# EAGLE design Carte_Fischertechnik_V3 (EAGLE 9.0.1)
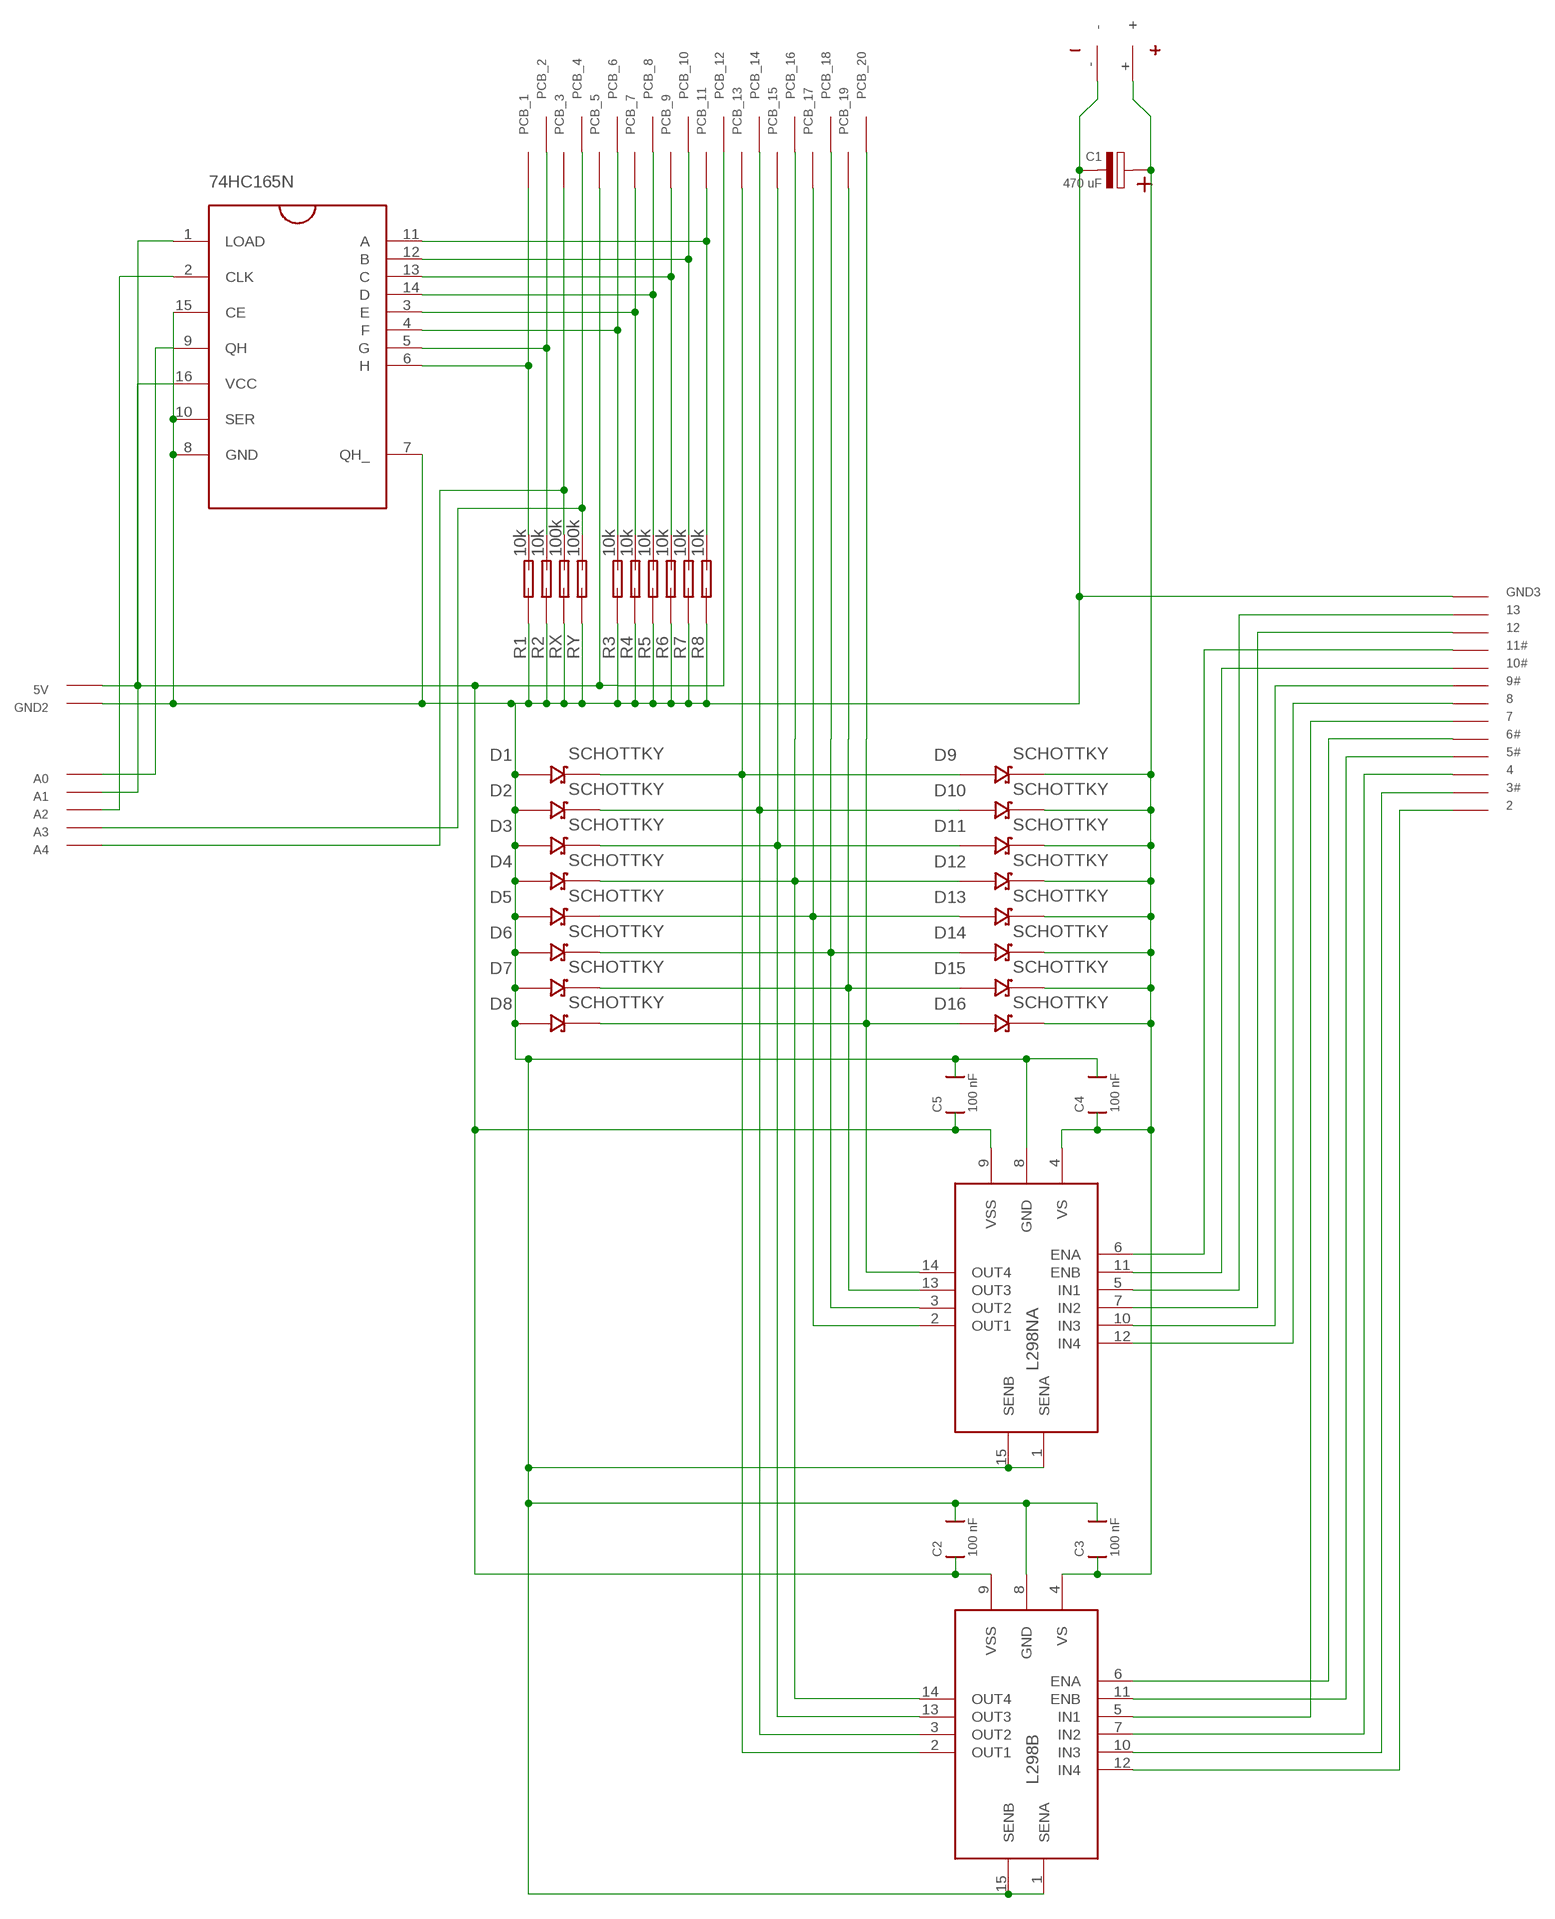
[diagram p0: schematic, sheet 1]

## Parts
2  PAD_O  [PAD_O]
3#  PAD_O  [PAD_O]
4  PAD_O  [PAD_O]
5#  PAD_O  [PAD_O]
5V  5V  PAD_O  [PAD_O]
6#  PAD_O  [PAD_O]
7  PAD_O  [PAD_O]
8  PAD_O  [PAD_O]
9#  PAD_O  [PAD_O]
10#  PAD_O  [PAD_O]
11#  PAD_O  [PAD_O]
12  PAD_O  [PAD_O]
13  PAD_O  [PAD_O]
74HC165N  74HC165N  [74HC165N]
A0  PAD_O  [PAD_O]
A1  PAD_O  [PAD_O]
A2  PAD_O  [PAD_O]
A3  PAD_O  [PAD_O]
A4  PAD_O  [PAD_O]
C1  470 uF  POLARIZED_CAPACITOR  [POLARIZED_CAPACITOR]
C2  100 nF  CAPACITOR  [CAPACITOR]
C3  100 nF  CAPACITOR  [CAPACITOR]
C4  100 nF  CAPACITOR  [CAPACITOR]
C5  100 nF  CAPACITOR  [CAPACITOR]
D1  SCHOTTKY  [SCHOTTKY]
D2  SCHOTTKY  [SCHOTTKY]
D3  SCHOTTKY  [SCHOTTKY]
D4  SCHOTTKY  [SCHOTTKY]
D5  SCHOTTKY  [SCHOTTKY]
D6  SCHOTTKY  [SCHOTTKY]
D7  SCHOTTKY  [SCHOTTKY]
D8  SCHOTTKY  [SCHOTTKY]
D9  SCHOTTKY  [SCHOTTKY]
D10  SCHOTTKY  [SCHOTTKY]
D11  SCHOTTKY  [SCHOTTKY]
D12  SCHOTTKY  [SCHOTTKY]
D13  SCHOTTKY  [SCHOTTKY]
D14  SCHOTTKY  [SCHOTTKY]
D15  SCHOTTKY  [SCHOTTKY]
D16  SCHOTTKY  [SCHOTTKY]
GND2  GND  PAD_O  [PAD_O]
GND3  PAD_O  [PAD_O]
L298B  L298N  [L298N]
L298NA  L298N  [L298N]
PCB_1  PAD_C  [PAD_C]
PCB_2  PAD_C  [PAD_C]
PCB_3  PAD_C  [PAD_C]
PCB_4  PAD_C  [PAD_C]
PCB_5  PAD_C  [PAD_C]
PCB_6  PAD_C  [PAD_C]
PCB_7  PAD_C  [PAD_C]
PCB_8  PAD_C  [PAD_C]
PCB_9  PAD_C  [PAD_C]
PCB_10  PAD_C  [PAD_C]
PCB_11  PAD_C  [PAD_C]
PCB_12  PAD_C  [PAD_C]
PCB_13  PAD_C  [PAD_C]
PCB_14  PAD_C  [PAD_C]
PCB_15  PAD_C  [PAD_C]
PCB_16  PAD_C  [PAD_C]
PCB_17  PAD_C  [PAD_C]
PCB_18  PAD_C  [PAD_C]
PCB_19  PAD_C  [PAD_C]
PCB_20  PAD_C  [PAD_C]
R1  10k  RESISTANCE  [RESISTANCE]
R2  10k  RESISTANCE  [RESISTANCE]
R3  10k  RESISTANCE  [RESISTANCE]
R4  10k  RESISTANCE  [RESISTANCE]
R5  10k  RESISTANCE  [RESISTANCE]
R6  10k  RESISTANCE  [RESISTANCE]
R7  10k  RESISTANCE  [RESISTANCE]
R8  10k  RESISTANCE  [RESISTANCE]
RX  100k  RESISTANCE  [RESISTANCE]
RY  100k  RESISTANCE  [RESISTANCE]
U$1  ADAPTATEUR_FTK  [ADAPTATEUR_FTK]

## Nets
N$1: D1.+ D9.- L298B.2(OUT1) PCB_13.$1
N$2: 5V.P$1 74HC165N.16(VCC) C2.P$1 C5.P$1 L298B.9(VSS) L298NA.9(VSS) PCB_5.$1 PCB_12.$1
N$3: 74HC165N.5(G) PCB_2.$1 R2.P$2(B)
N$4: D2.+ D10.- L298B.3(OUT2) PCB_14.$1
N$5: D3.+ D11.- L298B.13(OUT3) PCB_15.$1
N$6: 74HC165N.7(QH_) 74HC165N.8(GND) 74HC165N.10(SER) 74HC165N.15(CE) C1.P$2(-) C2.P$2 C3.P$2 C4.P$2 C5.P$2 D1.- D2.- D3.- D4.- D5.- D6.- D7.- D8.- GND2.P$1 GND3.P$1 L298B.1(SENA) L298B.8(GND) L298B.15(SENB) L298NA.1(SENA) L298NA.8(GND) L298NA.15(SENB) R1.P$1(A) R2.P$1(A) R3.P$1(A) R4.P$1(A) R5.P$1(A) R6.P$1(A) R7.P$1(A) R8.P$1(A) RX.P$1(A) RY.P$1(A) U$1.-
N$8: D5.+ D13.- L298NA.2(OUT1) PCB_17.$1
N$9: C1.P$1(+) C3.P$1 C4.P$1 D9.+ D10.+ D11.+ D12.+ D13.+ D14.+ D15.+ D16.+ L298B.4(VS) L298NA.4(VS) U$1.+
N$11: D4.+ D12.- L298B.14(OUT4) PCB_16.$1
N$12: 74HC165N.9(QH) A0.P$1
N$13: 74HC165N.2(CLK) A2.P$1
N$14: 74HC165N.1(LOAD) A1.P$1
N$15: 74HC165N.6(H) PCB_1.$1 R1.P$2(B)
N$16: A4.P$1 PCB_3.$1 RX.P$2(B)
N$17: A3.P$1 PCB_4.$1 RY.P$2(B)
N$19: 74HC165N.4(F) PCB_6.$1 R3.P$2(B)
N$20: 74HC165N.3(E) PCB_7.$1 R4.P$2(B)
N$21: 74HC165N.14(D) PCB_8.$1 R5.P$2(B)
N$22: 74HC165N.13(C) PCB_9.$1 R6.P$2(B)
N$23: 74HC165N.12(B) PCB_10.$1 R7.P$2(B)
N$24: 74HC165N.11(A) PCB_11.$1 R8.P$2(B)
N$27: 11#.P$1 L298NA.6(ENA)
N$28: 10#.P$1 L298NA.11(ENB)
N$29: 13.P$1 L298NA.5(IN1)
N$30: 12.P$1 L298NA.7(IN2)
N$31: D6.+ D14.- L298NA.3(OUT2) PCB_18.$1
N$32: D7.+ D15.- L298NA.13(OUT3) PCB_19.$1
N$33: D8.+ D16.- L298NA.14(OUT4) PCB_20.$1
N$34: 9#.P$1 L298NA.10(IN3)
N$35: 8.P$1 L298NA.12(IN4)
N$38: 7.P$1 L298B.5(IN1)
N$39: 6#.P$1 L298B.6(ENA)
N$40: 5#.P$1 L298B.11(ENB)
N$41: 4.P$1 L298B.7(IN2)
N$42: 3#.P$1 L298B.10(IN3)
N$43: 2.P$1 L298B.12(IN4)

## Library data of the parts
2 3# 4 5# 5V 6# 7 8 9# 10# 11# 12 13 A0 A1-A4 GND2 GND3 = Fischertechnik:PAD_O
74HC165N = Fischertechnik:74HC165N
C1 = Fischertechnik:POLARIZED_CAPACITOR
C2-C5 = Fischertechnik:CAPACITOR
D1-D16 = Fischertechnik:SCHOTTKY
L298B L298NA = Fischertechnik:L298N
PCB_1-PCB_20 = Fischertechnik:PAD_C
R1-R8 RX RY = Fischertechnik:RESISTANCE
U$1 = Ftk:ADAPTATEUR_FTK

## Net classes
0 default: width 0.5 mm, drill 0.3 mm, clearance 0.5 mm

## Board
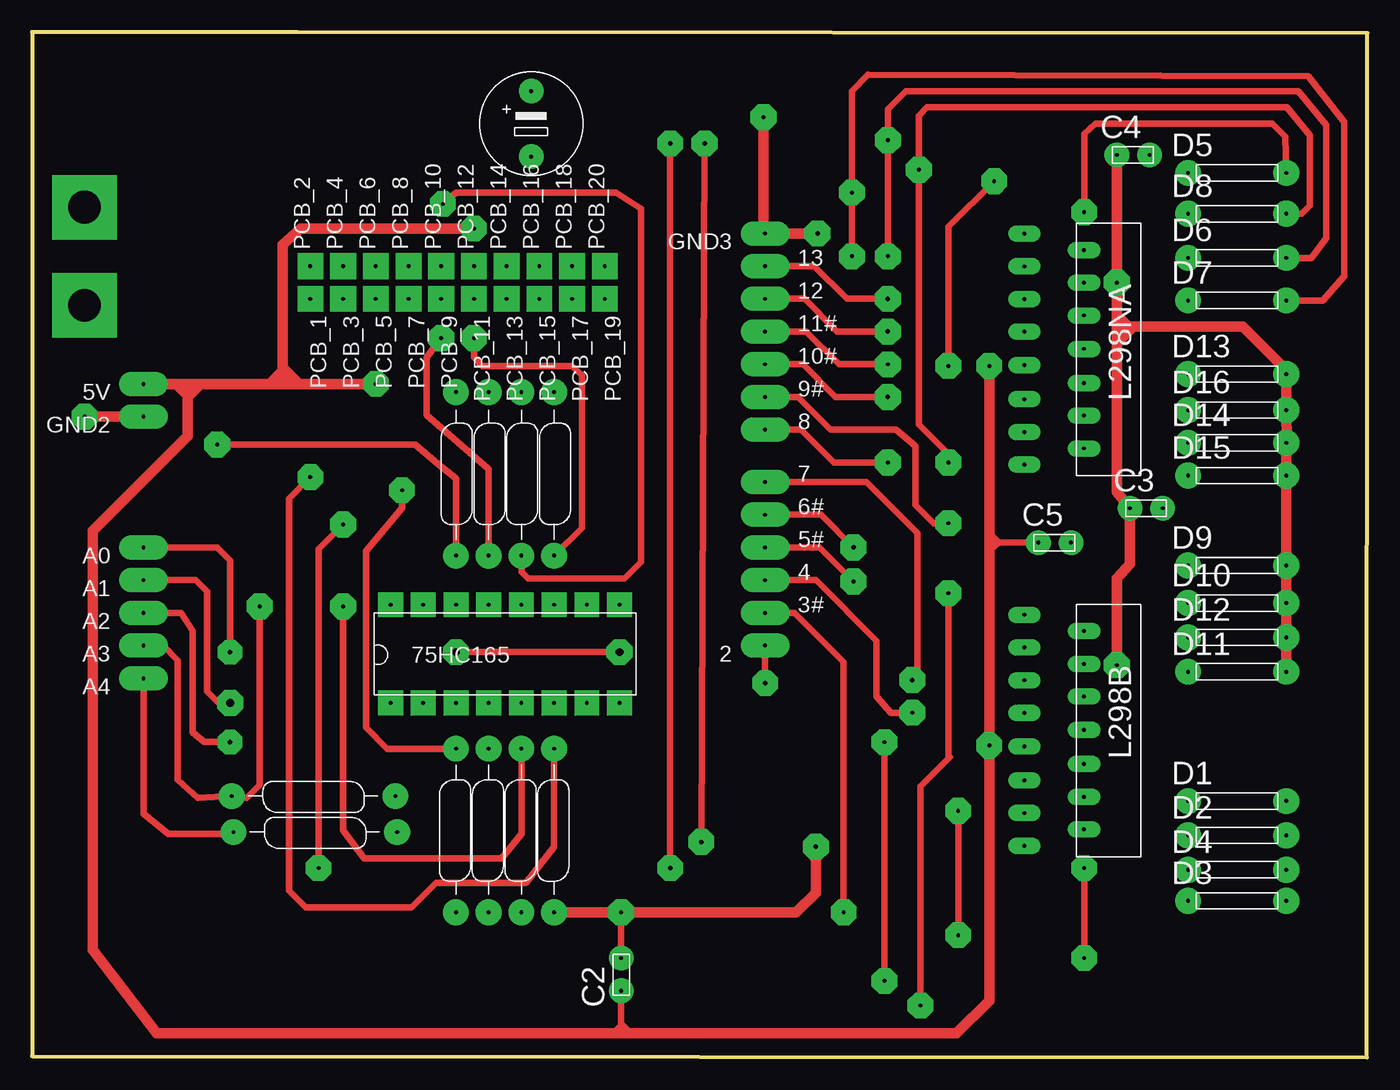
[diagram p1: board, top side]
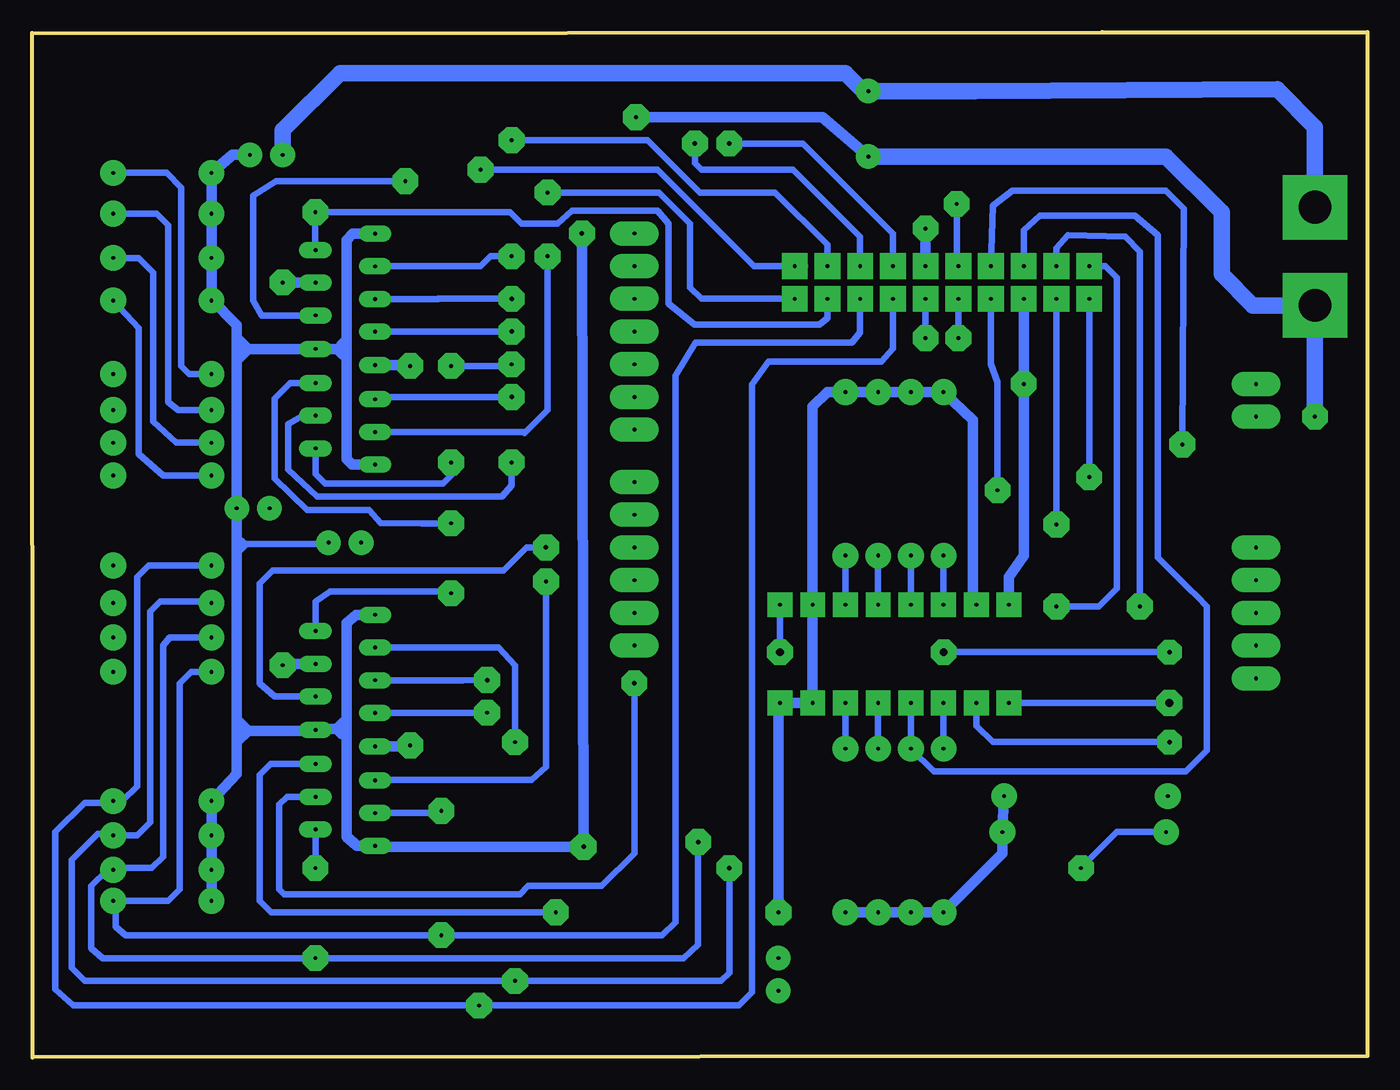
[diagram p2: board, bottom side, seen from below]

Size 103.64 x 79.6 mm. Coordinates in mm from the lower left corner, seen from the top.
Outline: 0,0.1 103.62,0 103.64,79.53 20.57,79.6 0,79.6 0,0.1
Copper layers (1*16): Top 0.035mm / dielectric 1.5mm / Bottom 0.035mm
Design rules "default *": minimum track width 6mil, minimum drill 0.35mm, track to track 2mil, track to pad 2mil, pad to pad 6mil, via to via 6mil, smd to smd 6mil, copper to edge 40mil, drill to drill 6mil, minimum pad ring 10mil, minimum via ring 8mil, stop-mask expansion 4mil, vias tented up to drill 0mil, thermal gap 10mil

### Footprints (pad centres in the part's own frame; a part is rotated, then mirrored left to right if it is on the bottom)
PAD_O = drill 0.3 pad 1.905 long: P$1 0,0
74HC165N = drill 0.3 pad 1.93 square: 1 -3.175,7.62; 2 -3.175,5.08; 3 -3.175,2.54; 4 -3.175,0; 5 -3.175,-2.54; 6 -3.175,-5.08; 7 -3.175,-7.62; 8 -3.175,-10.16; 9 4.445,-10.16; 10 4.445,-7.62; 11 4.445,-5.08; 12 4.445,-2.54; 13 4.445,0; 14 4.445,2.54; 15 4.445,5.08; 16 4.445,7.62
POLARIZED_CAPACITOR = drill 0.3 pad 1.91: P$1 -2.54,0; P$2 2.54,0
CAPACITOR = drill 0.3 pad 1.91: P$1 -1.27,0; P$2 1.27,0
SCHOTTKY = drill 0.3 pad 2: + 3.81,0; - -3.81,0
L298N = drill 0.3 pad 1.27 long: 1 -6.547,9; 2 -1.917,7.73; 3 -6.547,6.46; 4 -1.917,5.19; 5 -6.547,3.92; 6 -1.917,2.65; 7 -6.547,1.38; 8 -1.917,0.05; 9 -6.547,-1.22; 10 -1.917,-2.59; 11 -6.547,-3.86; 12 -1.917,-5.13; 13 -6.547,-6.4; 14 -1.917,-7.67; 15 -6.547,-8.94
PAD_C = drill 0.3 pad 2 square: $1 0,0
RESISTANCE = drill 0.3 pad 2: P$1 0,6.35; P$2 0,-6.35
ADAPTATEUR_FTK = drill 2.54 pad 5 square: + 3.81,0; - -3.81,0

### Placement (x,y rotation side)
2  56.9,31.98 90 top
3#  56.9,34.52 270 top
4  56.9,37.06 270 top
5#  56.9,39.6 270 top
5V  8.64,52.3 90 top
6#  56.9,42.14 270 top
7  56.9,44.68 270 top
8  56.9,48.74 270 top
9#  56.9,51.28 270 top
10#  56.9,53.82 270 top
11#  56.9,56.36 270 top
12  56.9,58.9 270 top
13  56.9,61.44 270 top
74HC165N  35.43,30.71 90 top
A0  8.64,39.6 90 top
A1  8.64,37.06 90 top
A2  8.64,34.52 90 top
A3  8.64,31.98 90 top
A4  8.64,29.44 90 top
C1  38.73,72.49 270 top
C2  45.72,6.45 90 top
C3  86.49,42.64 0 top
C4  85.47,70.08 0 top
C5  79.38,39.98 0 top
D1  93.54,19.91 0 top
D2  93.54,17.24 0 top
D3  93.54,12.16 0 top
D4  93.54,14.58 0 top
D5  93.54,68.68 0 top
D6  93.54,62.08 0 top
D7  93.54,58.77 0 top
D8  93.54,65.5 0 top
D9  93.54,38.2 0 top
D10  93.54,35.28 0 top
D11  93.54,29.95 0 top
D12  93.54,32.61 0 top
D13  93.54,53.06 0 top
D14  93.54,47.72 0 top
D15  93.54,45.19 0 top
D16  93.54,50.27 0 top
GND2  8.64,49.76 90 top
GND3  56.9,63.98 90 top
L298B  83.57,25.37 0 top
L298NA  83.57,54.96 0 top
PCB_1  21.59,58.9 180 top
PCB_2  21.59,61.44 0 top
PCB_3  24.13,58.9 180 top
PCB_4  24.13,61.44 0 top
PCB_5  26.67,58.9 180 top
PCB_6  26.67,61.44 0 top
PCB_7  29.21,58.9 180 top
PCB_8  29.21,61.44 0 top
PCB_9  31.75,58.9 180 top
PCB_10  31.75,61.44 0 top
PCB_11  34.29,58.9 180 top
PCB_12  34.29,61.44 0 top
PCB_13  36.83,58.9 180 top
PCB_14  36.83,61.44 0 top
PCB_15  39.37,58.9 180 top
PCB_16  39.37,61.44 0 top
PCB_17  41.91,58.9 180 top
PCB_18  41.91,61.44 0 top
PCB_19  44.45,58.9 180 top
PCB_20  44.45,61.44 0 top
R1  40.51,17.63 180 top
R2  37.97,17.63 180 top
R3  35.43,17.63 180 top
R4  32.89,17.63 180 top
R5  32.89,45.31 0 top
R6  35.43,45.31 0 top
R7  37.97,45.31 0 top
R8  40.51,45.31 0 top
RX  21.97,17.5 270 top
RY  21.84,20.29 270 top
U$1  4.06,62.2 90 top

### Tracks (layer width: path | path; a pad name or v marks a point on that pad's centre or on a via)
N$1  (via drill 0.3 pad 2)
  Top 0.5: v71.12,36.04 71.12,23.47 71.25,23.34 68.96,21.05 v68.96,4.04
  Bottom 0.5: PCB_13.$1 36.83,57.63 | 36.83,57.63 36.83,56.36 | L298B.2 81.65,35.42 80.52,36.17 73.53,36.17 | 73.53,36.17 73.28,36.17 | 36.83,57.63 36.83,55.03 37.72,54.01 46.48,54.01 47.75,52.23 47.75,5.05 48.77,4.04 v68.96,4.04 100.46,4.04 101.85,5.31 101.85,17.5 99.57,19.79 97.15,19.79 D1.+ 96.65,19.91 95.5,21.05 95.5,37.31 94.61,38.2 D9.- | 73.53,36.17 71.25,36.17 v71.12,36.04
N$2  (via drill 0.3 pad 2)
  Top 0.5: C2.P$1 45.72,2.64 | 45.72,2.64 45.72,2.39 | 45.72,2.39 45.72,1.88 | 43.81,2 43.81,1.88 | 45.72,2.64 45.72,2.51 45.09,1.88 | 45.72,2.39 46.23,1.88 46.74,1.88 46.48,1.88 45.72,2.64 | C5.P$1 75.56,39.98 | 75.56,39.98 74.42,39.98 74.29,39.85 | 74.29,40.74 75.06,39.98 | 75.06,39.98 75.56,39.98 | 75.56,39.98 74.93,39.98 74.29,39.34 75.06,39.98
  Top 0.8: v34.29,64.36 20.83,64.36 19.43,63.09 19.43,53.57 | 16.51,52.3 13.34,52.3 | 13.34,52.3 12.06,52.3 | 12.06,52.3 11.18,52.3 | 11.18,52.3 5V.P$1 | 16.76,52.3 16.51,52.3 | 16.51,52.3 18.41,52.3 | 18.41,52.3 19.43,52.3 | 19.43,52.3 20.57,52.3 | 20.57,52.3 v26.67,52.3 | 19.43,53.57 19.43,52.3 | 18.41,52.3 19.43,53.31 19.43,53.57 | 19.43,53.57 20.57,52.42 20.57,52.3 | v74.29,53.69 74.29,40.74 74.29,39.85 74.29,39.34 74.29,26.26 v74.29,24.23 74.29,4.42 71.75,1.88 46.74,1.88 45.72,1.88 45.09,1.88 43.81,1.88 43.18,1.88 42.42,1.88 9.65,1.88 4.7,8.35 4.7,40.87 12.06,48.23 12.06,51.28 | 12.06,51.28 12.06,52.3 | 11.18,52.3 12.06,51.41 12.06,51.28 | 12.06,51.28 13.08,52.3 13.34,52.3
  Bottom 0.8: v34.29,64.36 PCB_12.$1 | L298NA.9 74.34,53.74 v74.29,53.69 | L298B.9 74.37,24.15 v74.29,24.23 | PCB_5.$1 v26.67,52.3 26.67,38.96 27.81,37.31 74HC165N.16
N$3  (via drill 0.3 pad 2)
  Top 0.5: v24.13,35.02 24.13,17.63 25.78,15.47 36.45,15.47 37.97,17.37 R2.P$2
  Bottom 0.5: 74HC165N.5 R2.P$2 | PCB_2.$1 20.32,61.44 19.43,60.55 19.43,36.42 20.83,35.02 v24.13,35.02
N$4  (via drill 0.3 pad 2, 0.35 pad 2)
  Top 0.5: v49.53,70.97 v49.53,14.7 | v66.17,24.48 v66.17,5.94
  Bottom 0.5: v49.53,14.7 49.53,6.58 50.16,5.94 v66.17,5.94 99.57,5.94 100.58,6.96 100.58,15.34 98.55,17.37 97.15,17.37 | 97.15,17.37 D2.+ | L298B.3 67.42,31.83 66.17,30.45 v66.17,24.48 | D10.- 89.85,35.41 93.73,35.41 94.49,34.64 94.49,18.26 95.5,17.24 97.03,17.24 97.15,17.37 | v49.53,70.97 43.81,70.97 36.83,63.98 PCB_14.$1
N$5  (via drill 0.3 pad 2)
  Top 0.5: v71.88,19.15 v71.88,9.5
  Bottom 0.5: PCB_15.$1 39.37,56.28 40.01,55.52 52.15,55.52 53.72,52.93 53.72,10.51 54.74,9.5 v71.88,9.5 96.39,9.5 97.15,10.13 97.15,12.04 D3.+ 93.09,12.16 92.2,13.05 92.2,29.06 91.31,29.95 D11.- | L298B.13 72.06,18.97 v71.88,19.15
N$6  (via drill 0.3 pad 2, 0.35 pad 2)
  Top 0.5: C2.P$2 v45.72,11.28
  Top 0.8: v4.06,49.76 GND2.P$1 | v60.96,63.98 GND3.P$1 56.77,64.11 v56.77,73 | R1.P$1 v45.72,11.28 59.31,11.28 60.83,12.8 v60.83,16.36
  Bottom 0.5: 79.96,55.01 79.63,55.34 79.63,54.71 79.64,54.7 | 79.25,26.39 79.5,26.01 | 81.57,25.5 L298B.8 | 79.25,24.61 79.63,25.12 79.5,25.25 | 79.25,54.3 79.25,53.82 | 87.76,39.85 87.12,39.85 | 86.99,39.85 80.77,39.85 C5.P$2 | 87.76,40.49 87.12,39.85 | 87.12,39.85 86.99,39.85 | 87.76,38.71 87.76,39.09 86.99,39.85
  Bottom 0.8: R1.P$1 R2.P$1 R3.P$1 R4.P$1 28.32,15.85 RX.P$1 RY.P$1 | 74HC165N.15 30.61,35.15 30.61,49.5 R5.P$1 R6.P$1 R7.P$1 R8.P$1 41.91,51.66 43.05,50.52 74HC165N.10 74HC165N.7 74HC165N.8 45.72,27.4 v45.72,11.28 45.59,11.4 | L298NA.1 78.76,63.96 79.25,63.47 79.25,55.73 | 79.25,55.73 79.63,55.34 | L298NA.15 78.82,46.02 79.25,46.45 79.25,53.82 79.25,55.73 | L298B.1 78.5,34.37 79.25,33.75 79.25,26.39 79.25,24.61 79.25,17.12 78.44,16.43 L298B.15 76.84,16.36 v60.83,16.36 v60.96,63.98 | 80.01,25.5 79.5,26.01 79.5,25.25 | 80.01,25.5 81.57,25.5 81.7,25.37 86.87,25.37 | 79.63,25.12 80.01,25.5 | 79.25,54.3 79.64,54.7 79.96,55.01 L298NA.8 86.87,55.01 | C1.P$2 42.29,73 v56.77,73 | 89.79,58.9 D7.- | 87.76,25.37 86.87,25.37 | D3.- D4.- D2.- D1.- 87.76,22.01 87.76,24.48 | 87.76,24.48 87.76,25.37 | 87.76,25.37 87.76,26.26 | 86.87,25.37 87.76,26.26 | 86.87,25.37 87.76,24.48 | C4.P$2 88.07,70.08 D5.- D8.- D6.- 89.73,58.96 89.79,58.9 | 87.76,54.12 87.76,54.96 | 87.76,54.96 87.76,55.9 | 87.76,55.9 87.76,56.87 89.79,58.9 | 87.76,54.96 87.71,55.01 86.87,55.01 | 86.87,55.01 87.76,55.9 | 86.87,55.01 87.76,54.12 | 87.76,54.12 C3.P$2 87.76,40.49 87.76,39.85 87.76,38.71 87.76,26.26
  Bottom 1.27: C1.P$2 15.62,69.95 11.3,65.63 11.3,60.81 8.89,58.39 U$1.- v4.06,49.76
N$8  (via drill 0.3 pad 2)
  Top 0.5: v81.66,65.63 81.66,71.73 82.55,72.49 96.27,72.49 97.28,71.47 D5.+
  Bottom 0.5: L298NA.2 81.66,62.83 81.66,64.74 | 81.66,64.74 v81.66,65.63 | PCB_17.$1 41.91,57.41 42.55,56.9 52.23,56.9 54.23,58.52 54.23,64.74 55.12,65.76 61.72,65.76 62.87,64.74 65.66,64.74 66.55,65.63 v81.66,65.63 | 81.66,64.74 v81.66,65.63 | D5.+ 93.22,68.68 92.07,67.54 92.07,53.69 91.44,53.06 D13.-
N$9  (via drill 0.3 pad 2)
  Top 0.8: 84.2,57.63 v84.2,60.17 84.2,66.12 84.21,67.13 84.21,70.45 C4.P$1 | 84.2,57.63 84.2,56.74 | 84.2,56.74 85.09,56.74 | 85.47,56.74 93.98,56.74 97.41,53.31 D13.+ D16.+ 97.41,47.72 D14.+ D15.+ D9.+ D10.+ D12.+ D11.+ | 84.2,56.74 84.2,55.47 | 84.2,57.63 85.09,56.74 | 85.09,56.74 85.47,56.74 | 84.2,55.47 85.47,56.74 | 84.2,55.47 84.2,43.91 C3.P$1 85.22,38.33 84.2,37.18 v84.2,30.45
  Bottom 0.8: L298NA.4 83.29,60.15 v84.2,60.17 | v84.2,30.45 84.09,30.56 L298B.4 | 30.48,75.03 30.54,74.97
  Bottom 1.27: U$1.+ 4.06,72.24 6.98,75.16 30.48,75.03 C1.P$1 39.12,75.03 40.51,76.43 79.76,76.43 84.2,71.98 C4.P$1
N$11  (via drill 0.3 pad 2, 0.35 pad 2)
  Top 0.5: v52.2,70.97 v51.94,16.74 | v81.66,14.7 v81.66,7.72
  Bottom 0.5: v51.94,16.74 51.94,8.74 53.09,7.72 v81.66,7.72 98.17,7.72 99.06,8.48 99.06,13.31 97.79,14.58 D4.+ 97.22,14.7 94.36,14.7 93.47,15.59 93.47,31.98 92.96,32.61 D12.- | v81.66,14.7 81.65,14.72 L298B.14 | v52.2,70.97 52.2,69.44 51.69,68.93 44.58,68.93 39.37,63.73 PCB_16.$1
N$12  (via drill 0.35 pad 1.9, 0.6 pad 2)
  Top 0.5: v15.37,31.47 15.37,38.58 14.35,39.6 A0.P$1 | v32.89,31.47 v45.59,31.47
  Bottom 0.5: v15.37,31.47 v32.89,31.47 | v45.59,31.47 74HC165N.9
N$13  (via drill 0.35 pad 1.9)
  Top 0.5: 15.24,24.36 v15.37,24.48 13.34,24.48 12.45,25.25 12.45,33.12 11.56,34.52 A2.P$1
  Bottom 0.5: 74HC165N.2 30.35,25.75 29.08,24.48 v15.37,24.48
N$14  (via drill 0.6 pad 2)
  Top 0.5: A1.P$1 12.7,37.06 13.59,36.17 13.59,28.42 14.48,27.53 v15.37,27.53
  Bottom 0.5: v15.37,27.53 74HC165N.1
N$15  (via drill 0.3 pad 2)
  Top 0.5: v21.59,45.06 19.94,43.41 19.94,12.93 21.21,11.66 29.46,11.66 31.37,13.56 38.35,13.56 40.51,16.35 R1.P$2
  Bottom 0.5: 74HC165N.6 R1.P$2 | PCB_1.$1 v21.59,45.06
N$16  (via drill 0.3 pad 2)
  Top 0.5: v24.13,41.38 22.23,39.47 v22.23,14.7 | A4.P$1 8.64,18.9 10.54,17.37 15.49,17.37 RX.P$2
  Bottom 0.5: PCB_3.$1 v24.13,41.38 | RX.P$2 19.43,17.5 v22.23,14.7
N$17  (via drill 0.3 pad 2)
  Top 0.5: A3.P$1 10.16,31.98 11.3,30.83 11.3,21.56 12.83,20.17 RY.P$2 16.64,20.17 17.65,21.18 v17.65,35.02
  Bottom 0.5: PCB_4.$1 24.13,62.84 23.24,63.85 18.8,63.73 17.65,62.58 v17.65,35.02
N$19
  Bottom 0.5: 74HC165N.4 R3.P$2 33.66,22.2 14.1,22.2 12.45,23.85 12.45,35.02 13.21,35.79 13.84,36.42 16.26,38.83 16.26,49.76 16.26,63.85 18.03,65.38 25.4,65.38 26.67,64.23 PCB_6.$1
N$20  (via drill 0.3 pad 2)
  Top 0.5: R4.P$2 27.56,23.98 25.91,25.63 25.91,39.34 28.7,42.64 v28.7,44.04
  Bottom 0.5: 74HC165N.3 R4.P$2 | v28.7,44.04 28.7,44.3 28.7,52.42 29.21,53.82 PCB_7.$1
N$21  (via drill 0.3 pad 2)
  Top 0.5: R5.P$2 32.89,44.93 31.5,46.07 29.72,47.6 v14.35,47.6
  Bottom 0.5: 74HC165N.14 R5.P$2 | v14.35,47.6 14.22,65.89 15.62,67.28 27.56,67.28 29.08,66.14 PCB_8.$1
N$22  (via drill 0.3 pad 2)
  Top 0.5: v31.75,55.85 30.61,54.33 30.61,49.88 35.43,45.69 R6.P$2
  Bottom 0.5: 74HC165N.13 R6.P$2 | PCB_9.$1 v31.75,55.85
N$23  (via drill 0.3 pad 2)
  Top 0.5: v31.88,66.27 32.89,67.16 45.34,67.16 47.24,65.89 47.24,38.45 45.97,37.18 38.48,37.18 37.97,37.69 R7.P$2
  Bottom 0.5: 74HC165N.12 R7.P$2 | PCB_10.$1 arc90 31.88,61.57 v31.88,66.27
N$24  (via drill 0.3 pad 2)
  Top 0.5: v34.29,55.85 34.29,54.33 34.92,53.69 41.91,53.69 42.67,52.93 42.67,41.12 R8.P$2
  Bottom 0.5: 74HC165N.11 R8.P$2 | PCB_11.$1 v34.29,55.85
N$27  (via drill 0.3 pad 2)
  Top 0.5: 65.15,53.82 65.41,53.82 | v71.12,53.69 71.12,64.49 v74.68,68.05 | v66.42,53.82 65.15,53.82 | 65.15,53.82 62.61,53.82 60.07,56.36 11#.P$1
  Bottom 0.5: L298NA.6 85.83,57.61 86.49,58.77 86.49,66.9 84.71,68.05 v74.68,68.05 | v71.12,53.69 66.55,53.69 v66.42,53.82
N$28  (via drill 0.35 pad 2)
  Top 0.5: v66.42,51.28 62.36,51.28 59.82,53.82 10#.P$1
  Bottom 0.5: 57.07,53.64 10#.P$1 | v66.42,51.28 76.84,51.28 L298NA.11
N$29  (via drill 0.35 pad 2)
  Top 0.5: 13.P$1 60.71,61.44 63.25,58.9 v66.42,58.9
  Bottom 0.5: 56.91,61.42 13.P$1 | v66.42,58.9 72.14,58.9 72.15,58.88 L298NA.5
N$30  (via drill 0.35 pad 2)
  Top 0.5: v66.42,56.36 62.48,56.36 59.94,58.9 12.P$1
  Bottom 0.5: 56.91,58.88 12.P$1 | v66.42,56.36 77,56.36 L298NA.7
N$31  (via drill 0.3 pad 2)
  Top 0.5: v66.42,62.2 v66.42,71.22 66.42,73.63 67.82,75.03 98.3,75.03 100.46,72.36 100.46,63.6 99.31,62.08 D6.+
  Bottom 0.5: PCB_18.$1 41.91,63.09 45.97,67.16 47.5,67.16 47.75,67.16 51.82,67.16 55.88,71.22 v66.42,71.22 | D6.+ 95.38,62.08 94.23,60.93 94.23,49.38 92.46,47.72 D14.- | v66.42,62.2 68.07,62.2 68.85,61.42 L298NA.3
N$32  (via drill 0.3 pad 2)
  Top 0.5: v63.63,62.2 63.63,61.95 v63.63,67.16 63.63,75.03 64.9,76.3 99.06,76.17 101.85,72.62 101.85,60.68 100.2,58.77 D7.+
  Bottom 0.5: L298NA.13 73.36,48.56 65.48,48.56 65.41,48.49 63.63,50.27 v63.63,62.2 | PCB_19.$1 51.69,58.9 52.58,59.79 52.58,64.74 54.99,67.16 v63.63,67.16 | D7.+ 95.38,56.62 95.38,46.84 93.47,45.19 D15.-
N$33  (via drill 0.3 pad 2)  (1 unrouted)
  Top 0.5: D8.+ 98.55,65.5 99.19,66.14 99.19,71.6 97.41,73.76 69.47,73.76 68.83,73.12 v68.83,68.93 68.83,49.12 71.12,46.84 v71.12,46.2
  Bottom 0.5: 44.48,61.44 47.62,61.44 55.12,68.93 v68.83,68.93 | L298NA.14 81.65,45.3 80.9,44.55 71.75,44.55 71.12,45.19 v71.12,46.2 | D8.+ 93.98,65.5 93.09,64.62 93.09,50.9 92.33,50.27 D16.-
  Bottom 0.8: PCB_20.$1 43.81,61.44
N$34  (via drill 0.3 pad 2)
  Top 0.5: v71.12,41.47 70,41.47 68.58,42.9 68.58,47.47 67.06,48.74 61.98,48.74 59.44,51.28 9#.P$1
  Bottom 0.5: L298NA.10 83.62,52.37 84.84,51.15 84.84,44.93 82.3,42.52 77.47,42.52 76.58,41.5 73.38,41.47 v71.12,41.47
N$35  (via drill 0.3 pad 2)
  Top 0.5: 8.P$1 59.69,48.74 62.23,46.2 v66.42,46.2
  Bottom 0.5: L298NA.12 82.6,49.83 83.76,49.19 83.76,45.63 81.53,43.53 67.18,43.53 66.42,44.42 v66.42,46.2
N$38  (via drill 0.35 pad 2)
  Top 0.5: v68.33,29.31 68.33,29.18 68.71,29.95 68.71,34.52 68.71,40.74 64.77,44.68 7.P$1
  Bottom 0.5: L298B.5 70.25,29.29 v68.33,29.31
N$39  (via drill 0.35 pad 2)
  Top 0.5: 6#.P$1 61.21,42.14 v63.75,39.6
  Bottom 0.5: L298B.6 84.82,28.02 85.98,29.06 85.98,36.8 84.96,37.82 67.06,37.82 65.28,39.6 v63.75,39.6
N$40  (via drill 0.3 pad 2)
  Top 0.5: 63.53,37.18 v63.75,36.96 61.12,39.6 5#.P$1
  Bottom 0.5: v63.75,36.96 63.75,22.58 64.9,21.56 76.97,21.56 L298B.11
N$41  (via drill 0.3 pad 2)
  Top 0.5: v68.33,26.77 66.67,26.77 65.53,28.04 65.53,32.36 60.83,37.06 4.P$1
  Bottom 0.5: v68.33,26.77 76.88,26.77 L298B.7
N$42  (via drill 0.3 pad 2)
  Top 0.5: v62.99,11.28 62.99,30.71 59.18,34.52 3#.P$1
  Bottom 0.5: L298B.10 85.14,22.78 85.98,21.94 85.98,12.16 85.09,11.28 v62.99,11.28
N$43  (via drill 0.35 pad 2)
  Top 0.5: 2.P$1 v56.9,29.06
  Bottom 0.5: v56.9,29.06 56.9,15.85 59.44,13.31 65.15,13.31 65.79,12.67 84.07,12.67 84.45,13.05 84.45,19.66 83.87,20.24 L298B.12

### Text on the board
Reference: 470 uF | C2 | - | - | - | R=10k | C2 | C2 | D = 1N4148 | C2 = 100 nF | Rousseau R. 2018